# Altium schematic sheet Multi_HUTSCHIENE_EXT_1_1.SchDoc
size A4
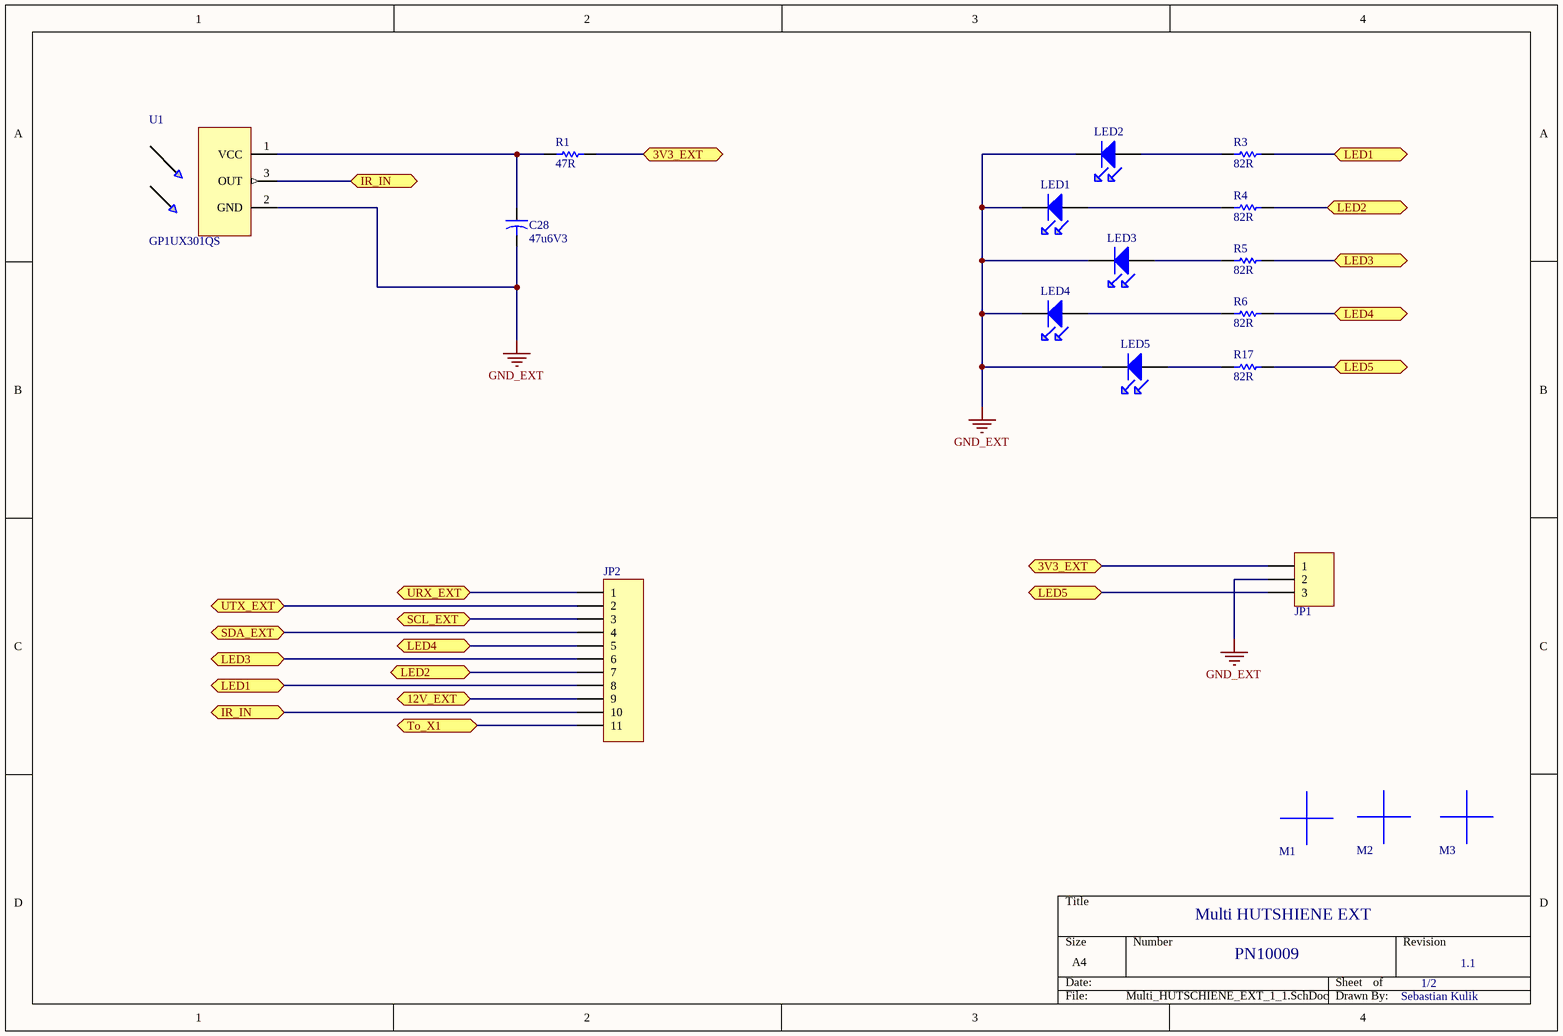
[diagram p0: Multi_HUTSCHIENE_EXT_1_1.SchDoc]

## Parts
C28  value 47u6V3  [C0805]  (hidden comment: 47u6V3_0805)
JP1  Plug_3_90_2.54  [HDR1X3-DOWN]  (value not drawn)
JP2  Plug_11_90_2.54  [HDR1X11_2.54-DOWN]  (value not drawn)
LED1  HSMG-120-Y  [HSMA-120-OR]  (value not drawn)
LED2  HSMG-120-GR  [HSMA-120-G]  (value not drawn)
LED3  HSMG-120-Y  [HSMA-120-OR]  (value not drawn)
LED4  HSMG-120-Y  [HSMA-120-OR]  (value not drawn)
LED5  HSMG-120-Y  [HSMA-120-OR]  (value not drawn)
M1  Mark  [Mark-3mm]  (value not drawn)
M2  Mark  [Mark-3mm]  (value not drawn)
M3  Mark  [Mark-3mm]  (value not drawn)
R1  value 47R  [R0603(1608)]  (hidden comment: 47R_0603)
R3  value 82R  [R0603(1608)]  (hidden comment: 82R_0603)
R4  value 82R  [R0603(1608)]  (hidden comment: 82R_0603)
R5  value 82R  [R0603(1608)]  (hidden comment: 82R_0603)
R6  value 82R  [R0603(1608)]  (hidden comment: 82R_0603)
R17  value 82R  [R0603(1608)]  (hidden comment: 82R_0603)
U1  GP1UX301QS  [IR-GP]

## Ports
3V3_EXT, 12V_EXT, IR_IN, LED1, LED2, LED3, LED4, LED5, SCL_EXT, SDA_EXT, To_X1, URX_EXT, UTX_EXT

## Nets
GND_EXT: C28.2 JP1.2 LED1.1(K) LED2.1(K) LED3.1(K) LED4.1(K) LED5.1(K) U1.2(GND)
3V3_EXT: JP1.1 R1.2 ; port 3V3_EXT
12V_EXT: JP2.9 ; port 12V_EXT
IR_IN: JP2.10 U1.3(OUT) ; port IR_IN
LED1: JP2.8 R3.2 ; port LED1
LED2: JP2.7 R4.2 ; port LED2
LED3: JP2.6 R5.2 ; port LED3
LED4: JP2.5 R6.2 ; port LED4
LED5: JP1.3 R17.2 ; port LED5
SCL_EXT: JP2.3 ; port SCL_EXT
SDA_EXT: JP2.4 ; port SDA_EXT
To_X1: JP2.11 ; port To_X1
URX_EXT: JP2.1 ; port URX_EXT
UTX_EXT: JP2.2 ; port UTX_EXT
NetC28_1: C28.1 R1.1 U1.1(VCC)
NetLED1_2: LED1.2(A) R4.1
NetLED2_2: LED2.2(A) R3.1
NetLED3_2: LED3.2(A) R5.1
NetLED4_2: LED4.2(A) R6.1
NetLED5_2: LED5.2(A) R17.1

## Notes on the sheet
- Multi HUTSHIENE EXT
- PN10009
- 1/2
- 1.1
- Sebastian Kulik

## Library data of the parts
C28 = 47u6V3_0805: Kemet  C series, X5R, 20%, 6.3V; Deliverer PartNr: 1572633RL; Manufacturer PartNr: C0805C476M9PACTU; Deliverer: Farnell; TDFE-PN: C0040; Published: 18.02.2014; Part Description: Kemet  C series, X5R, 20%, 6.3V; Publisher: Sebastian Kulik; PackageDescription: C0805; Manufacturer: Kemet
JP1 = Plug_3_90_2.54: Plug,-3-Pin; Manufacturer: WE; Manufacturer PartNr: 61300311021; Deliverer PartNr: 2356177; Deliverer: Farnell; TDE-PN: CON0011; Publisher: Sebastian Kulik
JP2 = Plug_11_90_2.54: Plug, 11-Pin; Manufacturer PartNr: HTSW-111-08-T-S-RA; Manufacturer: Semtec; Deliverer PartNr: 2009889; Deliverer: Farnell; TDE-PN: CON0009; LatestRevisionDate: 14.05.2014; LatestRevisionNote: Re-released for DXP Platform.; Publisher: Sebastian Kulik
LED1 LED3-LED5 = HSMG-120-Y: LED, 90°, yellow; Manufacturer PartNr: HSMG-C120; Deliverer PartNr: 1058355; Manufacturer: Avago; TDE-PN: DIS0012; Deliverer: Farnell; Published: 18.02.2014; PackageReference: HSMA120Y; Publisher: Sebastian Kulik; PackageDescription: HSMA120Y
LED2 = HSMG-120-GR: LED, 90°, green; Manufacturer PartNr: HSMG-C120; Deliverer PartNr: 1058364; Manufacturer: Avago; TDE-PN: DIS0011; Deliverer: Farnell; Published: 18.02.2014; PackageReference: HSMA120G; Publisher: Sebastian Kulik; PackageDescription: HSMA120G
R1 = 47R_0603: Vishay, CRCW series, 100mW, 1%; Manufacturer PartNr: CRCW060347R0FKEA; Deliverer PartNr: 2122502; TDE-PN: R0039; Deliverer: Farnell; Published: 18.02.2014; Publisher: Sebastian Kulik; PackageDescription: 0603; Manufacturer: Vishay; Part Desicription: Vishay, CRCW series, 100mW, 1%
R3-R6 R17 = 82R_0603: Vishay, CRCW series, 100mW, 1%; Manufacturer PartNr: CRCW060382R0FKEA; Deliverer PartNr: 2122228; TDE-PN: R0040; Deliverer: Farnell; Published: 18.02.2014; Publisher: Sebastian Kulik; PackageDescription: 0603; Manufacturer: Vishay; Part Desicription: Vishay, CRCW series, 100mW, 1%
U1 = GP1UX301QS: IR reseiver; Deliverer PartNr: 1243866; Manufacturer: Sharp; Deliverer: Farnell; TDE-PN: IC0039; Published: 17.02.2014; PackageReference: IR-GP; Publisher: Sebastian Kulik; Manufacturer PartNr: GP1UX301QS